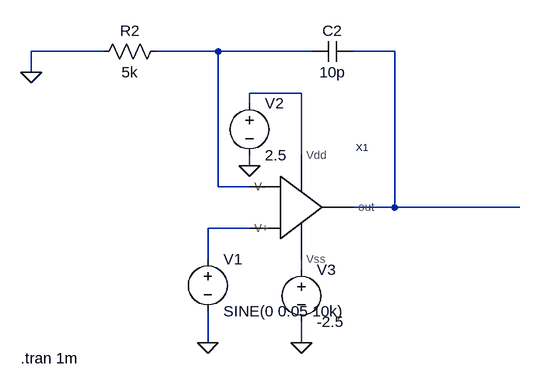
[diagram p0: schematic Draft22.asc]
Draft22.asc, the LTspice schematic file:
Version 4
SHEET 1 880 680
WIRE -96 -96 -208 -96
WIRE 80 -96 -16 -96
WIRE 224 -96 80 -96
WIRE 352 -96 288 -96
WIRE -208 -64 -208 -96
WIRE 208 -32 128 -32
WIRE 128 -16 128 -32
WIRE 208 64 208 -32
WIRE 128 80 128 64
WIRE 80 112 80 -96
WIRE 128 112 80 112
WIRE 352 144 352 -96
WIRE 352 144 288 144
WIRE 544 144 352 144
WIRE 128 176 64 176
WIRE 64 224 64 176
WIRE 208 240 208 224
WIRE 64 352 64 304
WIRE 208 352 208 320
FLAG 64 352 0
FLAG 208 352 0
FLAG 128 80 0
FLAG -208 -64 0
SYMBOL voltage 64 208 R0
WINDOW 123 0 0 Left 0
WINDOW 39 0 0 Left 0
SYMATTR InstName V1
SYMATTR Value SINE(0 0.05 10k)
SYMBOL voltage 128 -32 R0
WINDOW 123 0 0 Left 0
WINDOW 39 0 0 Left 0
SYMATTR InstName V2
SYMATTR Value 2.5
SYMBOL voltage 208 224 R0
WINDOW 123 0 0 Left 0
WINDOW 39 0 0 Left 0
SYMATTR InstName V3
SYMATTR Value -2.5
SYMBOL OPAMP 96 144 R0
SYMATTR InstName X1
SYMBOL cap 288 -112 R90
WINDOW 0 0 32 VBottom 2
WINDOW 3 32 32 VTop 2
SYMATTR InstName C2
SYMATTR Value 10p
SYMBOL res 0 -112 R90
WINDOW 0 0 56 VBottom 2
WINDOW 3 32 56 VTop 2
SYMATTR InstName R2
SYMATTR Value 5k
TEXT -224 376 Left 2 !.tran 1m

The netlist it stands for:
* Draft22.asc
V1 N004 0 SINE(0 0.05 10k)
V2 N003 0 2.5
V3 N005 0 -2.5
XX1 N003 N005 N001 N004 N002 OPAMP  ; pins Vdd Vss V- V+ out
C2 N002 N001 10p
R2 N001 0 5k
.tran 1m
.backanno
.end